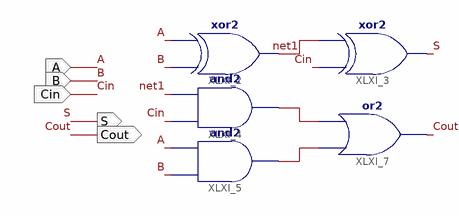
[diagram p0: schematic sheet 1]
// Xilinx ISE schematic FA_1bit.sch (virtex6) as structural Verilog: 5 symbols, 5 ports
module FA_1bit (
  input  A,
  input  B,
  input  Cin,
  output Cout,
  output S
);

  wire net1, XLXN_22, XLXN_23;

  xor XLXI_2 (net1, B, A);
  xor XLXI_3 (S, Cin, net1);
  and XLXI_5 (XLXN_23, B, A);
  or XLXI_7 (Cout, XLXN_23, XLXN_22);
  and XLXI_4 (XLXN_22, Cin, net1);
endmodule
